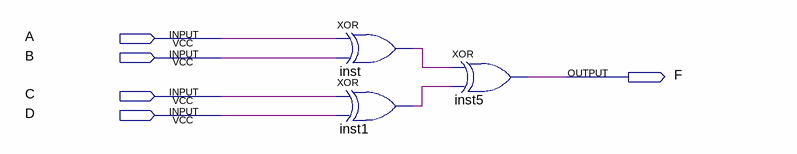
[diagram p0: schematic sheet]
// Quartus schematic four_xorGate.bdf as structural Verilog: 3 symbols, 5 pins
module four_xorGate (
  input  A,
  input  B,
  input  C,
  input  D,
  output F
);

  wire inst1_out, inst_out;

  xor inst (inst_out, A, B);
  xor inst1 (inst1_out, C, D);
  xor inst5 (F, inst_out, inst1_out);
endmodule
